# Altium schematic sheet MCU.SchDoc
size A4; DocumentNumber: 3; SheetNumber: 3; SheetTotal: 5
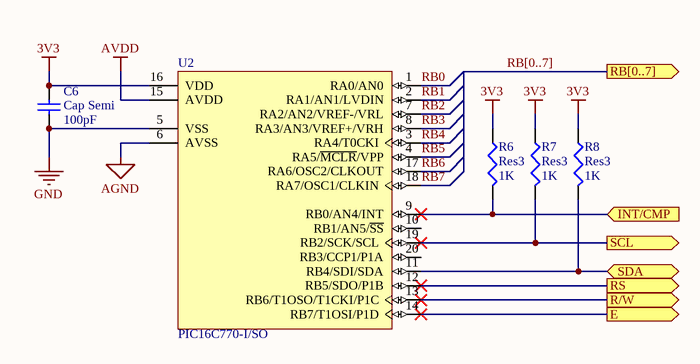
[diagram p0: MCU.SchDoc]

## Parts
C6  Cap Semi  value 100pF  [0603_C]
R6  Res3  value 1K  [0603_R]
R7  Res3  value 1K  [0603_R]
R8  Res3  value 1K  [0603_R]
U2  PIC16C770-I/SO  [SOIC-20_300mil]

## Ports
E (out), INT/CMP (in), R/W (out), RB[0..7] (out), RS (out), SCL (out), SDA (bidir)

## Nets
3V3: C6.2 R6.1 R7.1 R8.1 U2.16(VDD)
AGND: U2.6(AVSS)
AVDD: U2.15(AVDD)
GND: C6.1 U2.5(VSS)
E: U2.14(RB7/T1OSI/P1D) ; port E
INT/CMP: R6.2 U2.9(RB0/AN4/INT) ; port INT/CMP
R/W: U2.13(RB6/T1OSO/T1CKI/P1C) ; port R/W
RB0: U2.1(RA0/AN0)
RB1: U2.2(RA1/AN1/LVDIN)
RB2: U2.7(RA2/AN2/VREF-/VRL)
RB3: U2.8(RA3/AN3/VREF+/VRH)
RB4: U2.3(RA4/T0CKI)
RB5: U2.4(RA5/~{MCLR}/VPP)
RB6: U2.17(RA6/OSC2/CLKOUT)
RB7: U2.18(RA7/OSC1/CLKIN)
RS: U2.12(RB5/SDO/P1B) ; port RS
SCL: R7.2 U2.19(RB2/SCK/SCL) ; port SCL
SDA: R8.2 U2.11(RB4/SDI/SDA) ; port SDA

Not connected (* = marked no-connect by the designer): U2 10(RB1/AN5/~{SS}) 20(RB3/CCP1/P1A)

## Buses and harness runs
bus RB[0..7] = port RB[0..7]

## Library data of the parts
C6 = Cap Semi: Capacitor (Semiconductor SIM Model); Published: 8-Jun-2000; LatestRevisionDate: 29-May-2009; LatestRevisionNote: IPC-7351 Footprint Added.; PackageReference: C1206; Publisher: Altium Limited; PackageDescription: Chip Capacitor
R6-R8 = Res3: Resistor; Published: 8-Jun-2000; LatestRevisionDate: 29-May-2009; LatestRevisionNote: IPC-7351 Footprint Added.; PackageReference: J1-0603; Publisher: Altium Limited; PackageDescription: Chip Resistor
U2 = PIC16C770-I/SO: 8-Bit CMOS Microcontroller with 12-Bit A/D, 2K (x14-Bit words) EPROM, 256 Bytes RAM, 20-Pin SOIC, 4.0 to 5.5V Supply Range, Industrial Temperature; ComponentAvailability: Unknown. Contact manufacturer to determine status.; Published: 11-Oct-2004; LatestRevisionDate: 29-Jan-2009; LatestRevisionNote: Sch. layout revised. 3D Model Removed.; DatasheetVersion: revB, Feb-2002; PackageVersion: revBB, Aug-2009; PackageReference: SOIC-SO20; Publisher: Altium Limited; PackageDescription: 20-Lead Plastic Small Outline (SO) - Wide 7.50mm Body [SOIC]; Supplier 1: Digi-Key; Supplier Part Number 1: PIC16C770-I/SO-ND; Code_JEDEC: MS-013-AC; Code_IPC: SOIC127P1030-20; ComponentLink1Description: Datasheet; ComponentLink1URL: http://ww1.microchip.com/downloads/en/DeviceDoc/41120b.pdf; ComponentLink2Description: Packaging Specification; ComponentLink2URL: http://www.microchip.com/stellent/groups/techpub_sg/documents/packagingspec/en012702.pdf; ComponentLink3Description: Microchip.com Home; ComponentLink3URL: http://www.microchip.com/